# EAGLE design Dual Power Supply (EAGLE 9.6.2)
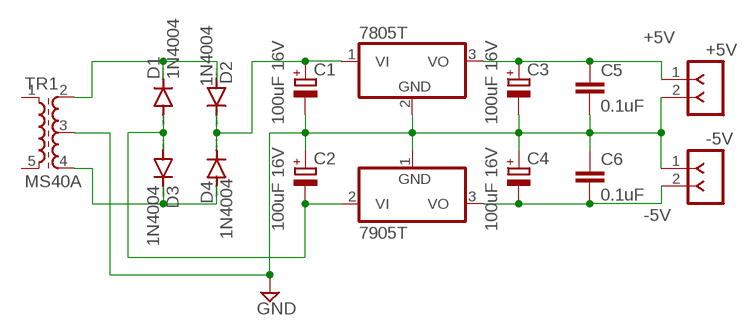
[diagram p0: schematic, sheet 1]

## Parts
7805T  7805T  [TO220H]
7905T  7905T  [TO220H]
+5V  F-1X02-SIP-100-40Y  [SIP-100-02-40Y]
-5V  F-1X02-SIP-100-40Y  [SIP-100-02-40Y]
C1  100uF 16V  CPOL-EUSANYO_C6  [SANYO-OSCON_C6]
C2  100uF 16V  CPOL-EUSANYO_C6  [SANYO-OSCON_C6]
C3  100uF 16V  CPOL-EUSANYO_C6  [SANYO-OSCON_C6]
C4  100uF 16V  CPOL-EUSANYO_C6  [SANYO-OSCON_C6]
C5  0.1uF  C-EU025-024X044  [C025-024X044]
C6  0.1uF  C-EU025-024X044  [C025-024X044]
D1  1N4004  [DO41-10]
D2  1N4004  [DO41-10]
D3  1N4004  [DO41-10]
D4  1N4004  [DO41-10]
TR1  MS40A  [MS40]

## Nets
+5V: 7805T.3(VO) +5V.1 C3.+ C5.1
-5V: 7905T.3(VO) -5V.2 C4.- C6.2
GND: 7805T.2(GND) 7905T.1(GND) +5V.2 -5V.1 C1.- C2.+ C3.- C4.+ C5.2 C6.1 TR1.3
N$1: D1.C D2.A TR1.2
N$2: D3.C D4.A TR1.4
N$3: 7905T.2(VI) C2.- D1.A D3.A
N$4: 7805T.1(VI) C1.+ D2.C D4.C
Unconnected: TR1.1 TR1.5

## Library data of the parts
7805T = linear:78*: Positive VOLTAGE REGULATOR Source: http://cache.national.com/ds/LM/LM78L05.pdf http://www.fairchildsemi.com/ds/LM/LM7805.pdf
7905T = linear:79*: Negative VOLTAGE REGULATOR
+5V -5V = con-headers-jp:F-1X02-: FEMALE HEADER
C1-C4 = rcl:CPOL-EU: POLARIZED CAPACITOR, European symbol; SPICEPREFIX: C
C5 C6 = rcl:C-EU: CAPACITOR, European symbol; SPICEPREFIX: C
D1-D4 = diode:1N4004: DIODE general purpose rectifier, 1 A
TR1 = inductor-neosid:MS40: TRANSFORMER SMD transformer acc. to customer specification; OC_FARNELL: unknown; OC_NEWARK: unknown

## Board
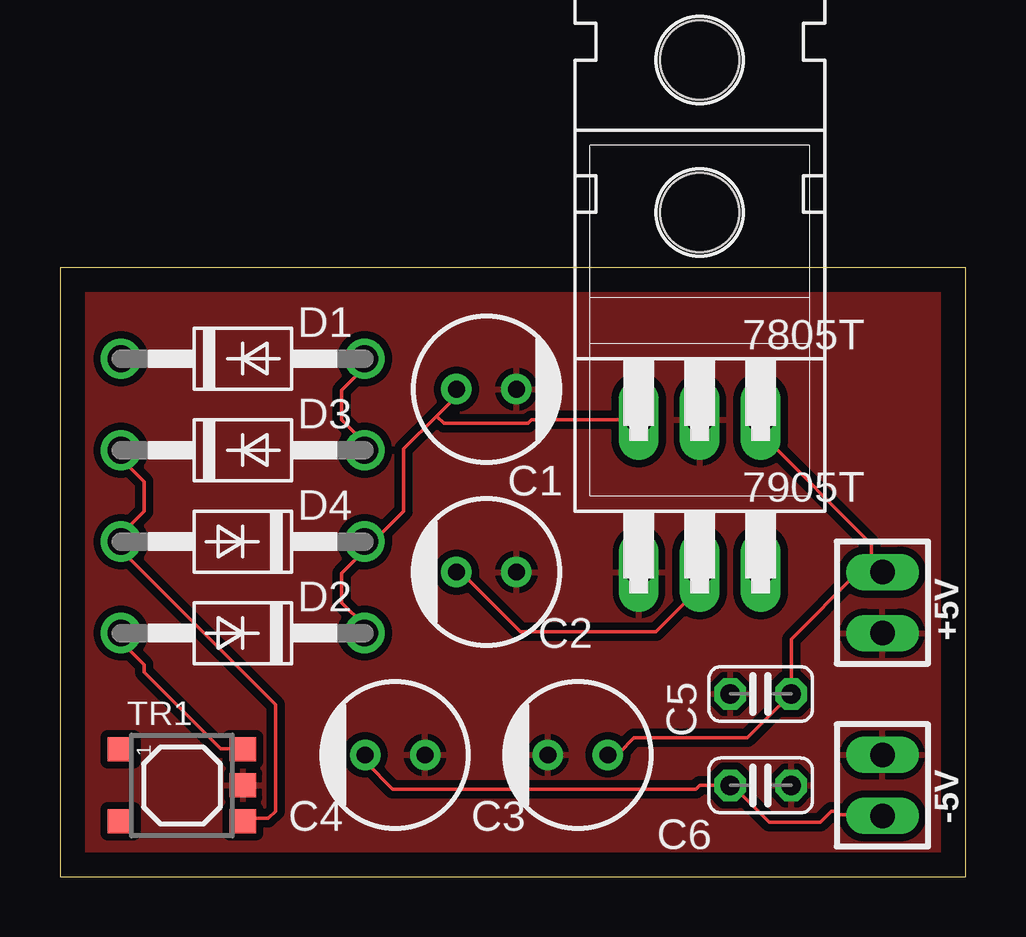
[diagram p1: board, top side]
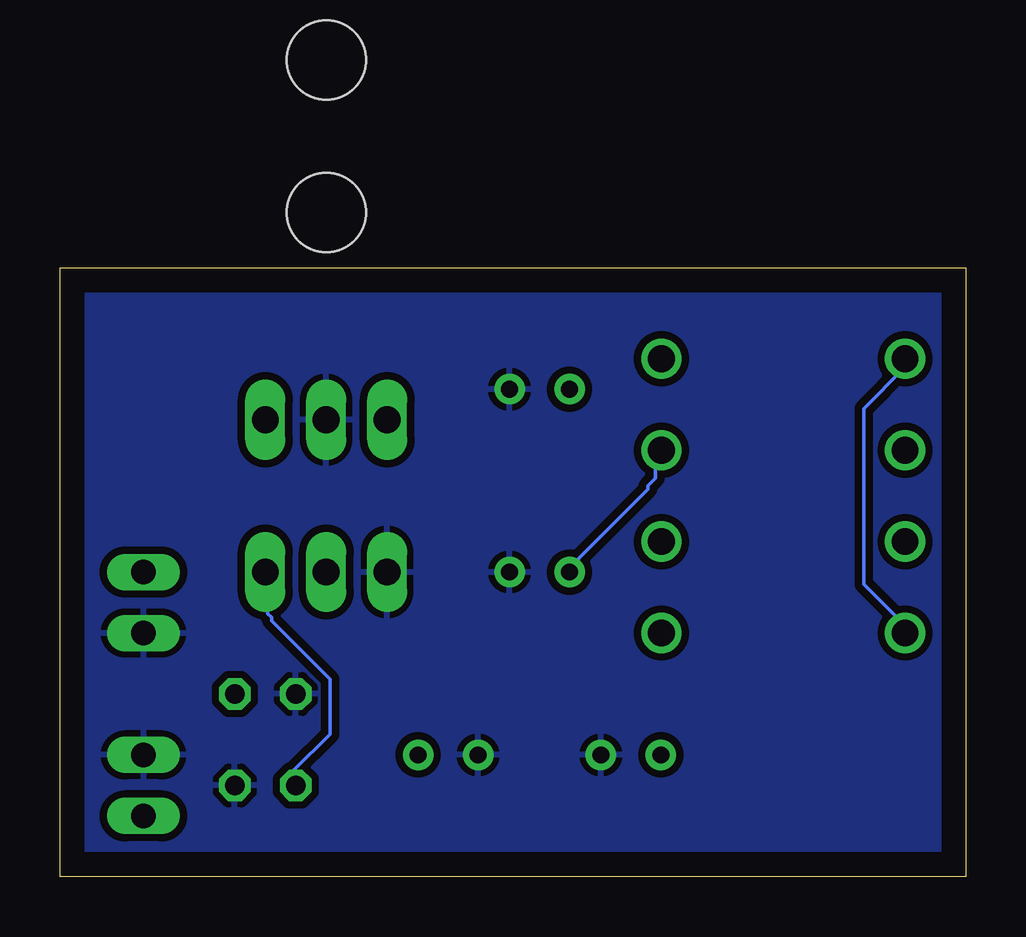
[diagram p2: board, bottom side, seen from below]

Size 37.77 x 25.39 mm. Coordinates in mm from the lower left corner, seen from the top.
Outline: 0,0 37.77,0 37.77,25.39 0,25.39 0,0
Copper layers (1*16): Top 0.035mm / dielectric 1.5mm / Bottom 0.035mm
Design rules "default": minimum track width 6mil, minimum drill 0.35mm, track to track 6mil, track to pad 6mil, pad to pad 6mil, via to via 6mil, smd to smd 6mil, copper to edge 40mil, drill to drill 6mil, minimum pad ring 10mil, minimum via ring 8mil, stop-mask expansion 4mil, vias tented up to drill 0mil, thermal gap 10mil

### Footprints (pad centres in the part's own frame; a part is rotated, then mirrored left to right if it is on the bottom)
TO220H = drill 1.118 long: 1 -2.54,-10.16; 2 0,-10.16; 3 2.54,-10.16 | hole 3.302: 0,4.826
SIP-100-02-40Y = drill 1.016 long: 1 -1.27,0; 2 1.27,0
SANYO-OSCON_C6 = drill 0.7 pad 1.27: + 1.25,0; - -1.25,0
C025-024X044 = drill 0.813 octagon: 1 -1.27,0; 2 1.27,0
DO41-10 = drill 1.118: A 5.08,0; C -5.08,0
MS40 = smd 1 x 1.1: 1 -1.5,-2.55; 2 -1.5,2.55; 3 0,2.55; 4 1.5,2.55; 5 1.5,-2.55

### Placement (x,y rotation side)
7805T  26.67,29.21 0 top
7905T  26.67,22.86 0 top
+5V  34.29,11.43 270 top
-5V  34.29,3.81 270 top
C1  17.78,20.32 180 top
C2  17.78,12.7 0 top
C3  21.59,5.08 0 top
C4  13.97,5.08 0 top
C5  29.21,7.62 180 top
C6  29.21,3.81 180 top
D1  7.62,21.59 0 top
D2  7.62,10.16 180 top
D3  7.62,17.78 0 top
D4  7.62,13.97 180 top
TR1  5.08,3.81 270 top

### Tracks (layer width: path | path; a pad name or v marks a point on that pad's centre or on a via)
+5V
  Top 0.152: C3.+ 22.86,5.18 23.32,5.18 23.93,5.79 28.65,5.79 C5.1 30.48,9.91 33.22,12.65 33.83,12.65 | 33.83,12.65 34.29,12.65 +5V.1 33.83,12.65 | 33.83,12.65 33.83,13.87 29.26,18.44 29.26,19.05 7805T.3
-5V
  Top 0.152: C4.- 12.8,5.03 12.8,4.72 13.87,3.66 26.52,3.66 26.67,3.81 C6.2 28.04,3.81 29.57,2.29 31.7,2.29 32.16,2.74 32.31,2.74 32.46,2.59 34.29,2.59 -5V.2
  Bottom 0.152: 7905T.3 29.11,12.65 29.11,10.97 28.96,10.82 28.96,10.67 26.52,8.23 26.52,5.94 28.04,4.42 28.04,3.81 C6.2
GND
  pour Bottom (isolate 0.305): 0,25.4 38.1,25.4 38.1,0 0,0
  pour Top (isolate 0.305): 0,25.4 38.1,25.4 38.1,0 0,0
N$1
  Top 0.152: TR1.2 7.62,5.33 6.71,5.33 3.5,8.53 3.5,8.84 2.59,9.75 2.59,10.06 D2.A
  Bottom 0.152: D1.C 2.59,21.49 2.59,21.18 4.27,19.51 4.27,12.19 2.59,10.52 2.59,10.21 D2.A
N$2
  Top 0.152: TR1.4 7.77,2.44 8.69,2.44 8.99,2.74 8.99,7.16 2.59,13.56 2.59,13.87 D4.A 2.59,14.02 2.59,14.33 3.5,15.24 3.5,16.46 2.59,17.37 2.59,17.68 D3.C
N$3
  Top 0.152: D1.A 12.65,21.49 12.65,21.18 11.73,20.27 11.73,19.05 12.65,18.14 12.65,17.83 D3.A | 7905T.2 26.67,12.04 24.84,10.21 19.2,10.21 16.61,12.8 C2.-
  Bottom 0.152: D3.A 12.95,17.53 12.95,16.61 13.26,16.31 13.26,16.15 16.15,13.26 16.15,13.11 16.46,12.8 C2.-
N$4
  Top 0.152: 15.7,19.2 14.33,17.83 14.33,15.24 13.11,14.02 12.8,14.02 D4.C 12.65,13.87 12.65,13.56 11.73,12.65 11.73,11.43 12.65,10.52 12.65,10.21 D2.C | 15.7,19.2 16.46,19.96 16.46,20.27 C1.+ | 7805T.1 19.66,19.05 19.51,18.9 16,18.9 15.7,19.2